# EAGLE design DIN (EAGLE 7.2.0)
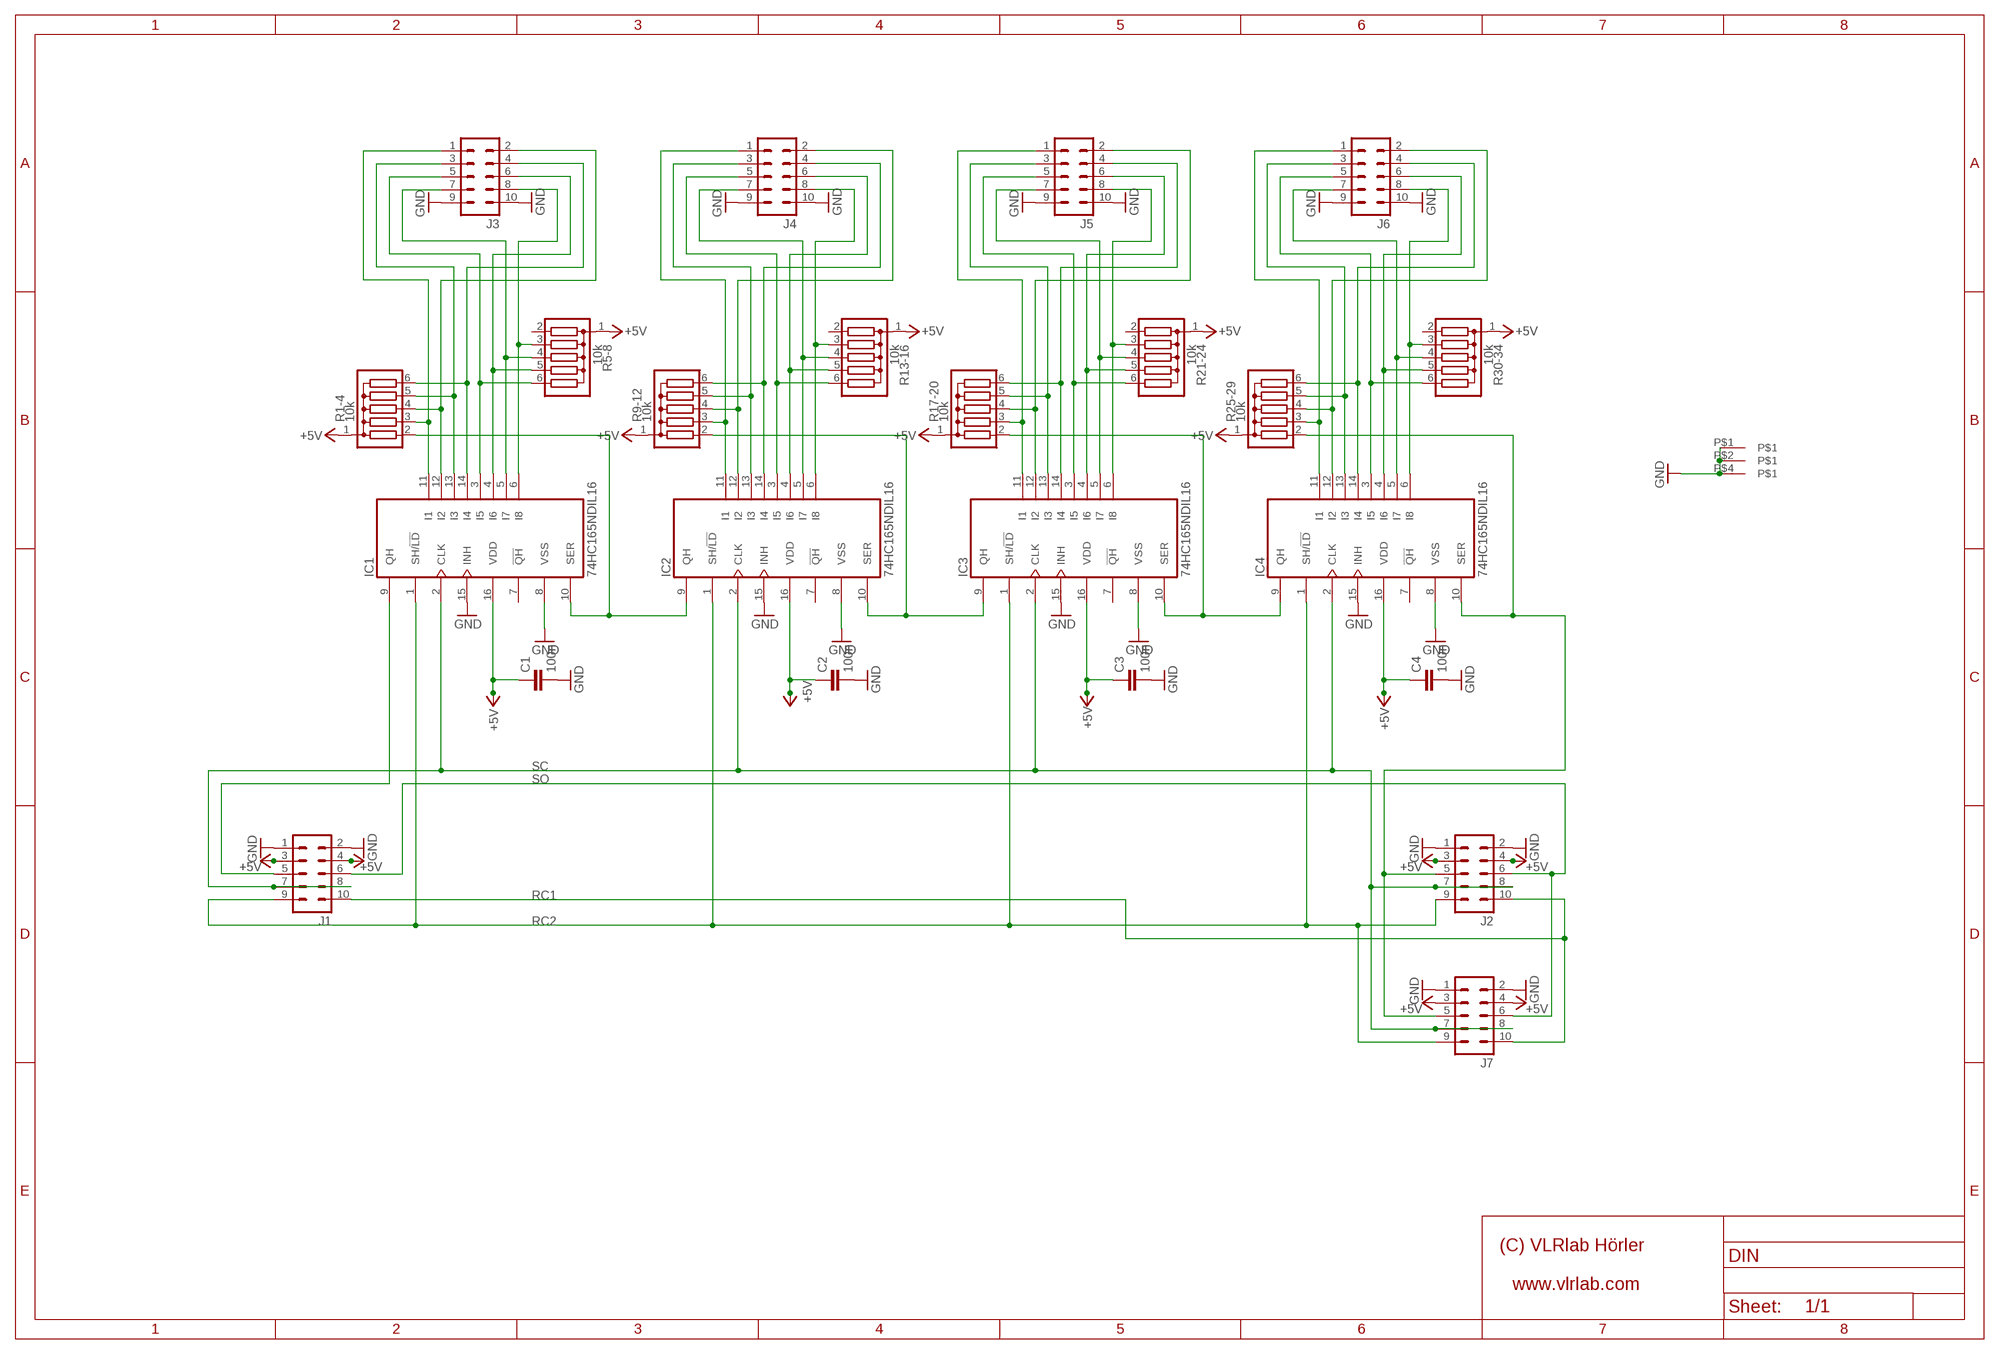
[diagram p0: schematic, sheet 1]

## Parts
C1  100n  C-EU025-025X050  [C025-025X050]
C2  100n  C-EU025-025X050  [C025-025X050]
C3  100n  C-EU025-025X050  [C025-025X050]
C4  100n  C-EU025-025X050  [C025-025X050]
IC1  74HC165NDIL16  [DIL16]
IC2  74HC165NDIL16  [DIL16]
IC3  74HC165NDIL16  [DIL16]
IC4  74HC165NDIL16  [DIL16]
J1  ML10  [ML10]
J2  ML10  [ML10]
J3  ML10  [ML10]
J4  ML10  [ML10]
J5  ML10  [ML10]
J6  ML10  [ML10]
J7  ML10  [ML10]
R1-4  10k  4306R  [SIL6]
R5-8  10k  4306R  [SIL6]
R9-12  10k  4306R  [SIL6]
R13-16  10k  4306R  [SIL6]
R17-20  10k  4306R  [SIL6]
R21-24  10k  4306R  [SIL6]
R25-29  10k  4306R  [SIL6]
R30-34  10k  4306R  [SIL6]
U$7  MIDIBOX_HALF  [MIDIBOX14X6]

## Nets
+5V: C1.1 C2.1 C3.1 C4.1 IC1.16(VDD) IC2.16(VDD) IC3.16(VDD) IC4.16(VDD) J1.3 J1.4 J2.3 J2.4 J7.3 J7.4 R1-4.1 R5-8.1 R9-12.1 R13-16.1 R17-20.1 R21-24.1 R25-29.1 R30-34.1
GND: C1.2 C2.2 C3.2 C4.2 IC1.8(VSS) IC1.15(INH) IC2.8(VSS) IC2.15(INH) IC3.8(VSS) IC3.15(INH) IC4.8(VSS) IC4.15(INH) J1.1 J1.2 J2.1 J2.2 J3.9 J3.10 J4.9 J4.10 J5.9 J5.10 J6.9 J6.10 J7.1 J7.2 U$7.P$1 U$7.P$2 U$7.P$4
N$1: IC1.11(I1) J3.1 R1-4.3
N$2: IC1.12(I2) J3.2 R1-4.4
N$35: IC1.13(I3) J3.3 R1-4.5
N$36: IC1.14(I4) J3.4 R1-4.6
N$37: IC1.3(I5) J3.5 R5-8.6
N$38: IC1.4(I6) J3.6 R5-8.5
N$39: IC1.5(I7) J3.7 R5-8.4
N$40: IC1.6(I8) J3.8 R5-8.3
N$41: IC2.11(I1) J4.1 R9-12.3
N$42: IC2.12(I2) J4.2 R9-12.4
N$43: IC2.13(I3) J4.3 R9-12.5
N$44: IC2.14(I4) J4.4 R9-12.6
N$45: IC2.3(I5) J4.5 R13-16.6
N$46: IC2.4(I6) J4.6 R13-16.5
N$47: IC2.5(I7) J4.7 R13-16.4
N$48: IC2.6(I8) J4.8 R13-16.3
N$49: IC3.11(I1) J5.1 R17-20.3
N$50: IC3.12(I2) J5.2 R17-20.4
N$51: IC3.13(I3) J5.3 R17-20.5
N$52: IC3.14(I4) J5.4 R17-20.6
N$53: IC3.3(I5) J5.5 R21-24.6
N$54: IC3.4(I6) J5.6 R21-24.5
N$55: IC3.5(I7) J5.7 R21-24.4
N$56: IC3.6(I8) J5.8 R21-24.3
N$57: IC4.11(I1) J6.1 R25-29.3
N$58: IC4.12(I2) J6.2 R25-29.4
N$59: IC4.13(I3) J6.3 R25-29.5
N$60: IC4.14(I4) J6.4 R25-29.6
N$61: IC4.3(I5) J6.5 R30-34.6
N$62: IC4.4(I6) J6.6 R30-34.5
N$63: IC4.5(I7) J6.7 R30-34.4
N$64: IC4.6(I8) J6.8 R30-34.3
N$67: IC1.10(SER) IC2.9(QH) R1-4.2
N$68: IC2.10(SER) IC3.9(QH) R9-12.2
N$69: IC3.10(SER) IC4.9(QH) R17-20.2
RC1: J1.10 J2.10 J7.10
RC2: IC1.1(SH/!LD) IC2.1(SH/!LD) IC3.1(SH/!LD) IC4.1(SH/!LD) J1.9 J2.9 J7.9
SC: IC1.2(CLK) IC2.2(CLK) IC3.2(CLK) IC4.2(CLK) J1.7 J1.8 J2.7 J2.8 J7.7 J7.8
SI: IC1.9(QH) J1.5
SI2: IC4.10(SER) J2.5 J7.5 R25-29.2
SO: J1.6 J2.6 J7.6
Unconnected: IC1.7(!QH) IC2.7(!QH) IC3.7(!QH) IC4.7(!QH) R5-8.2 R13-16.2 R21-24.2 R30-34.2

## Library data of the parts
C1-C4 = rcl:C-EU: CAPACITOR, European symbol
IC1-IC4 = 595-541-165-uln2803:74HC165N
J1-J7 = con-ml:ML10: HARTING; OC_FARNELL: unknown; OC_NEWARK: unknown
R1-4 R5-8 R9-12 R13-16 R17-20 R21-24 R25-29 R30-34 = Bourns Resistor Array:4306R
U$7 = Frames_VLR:MIDIBOX_HALF

## Board
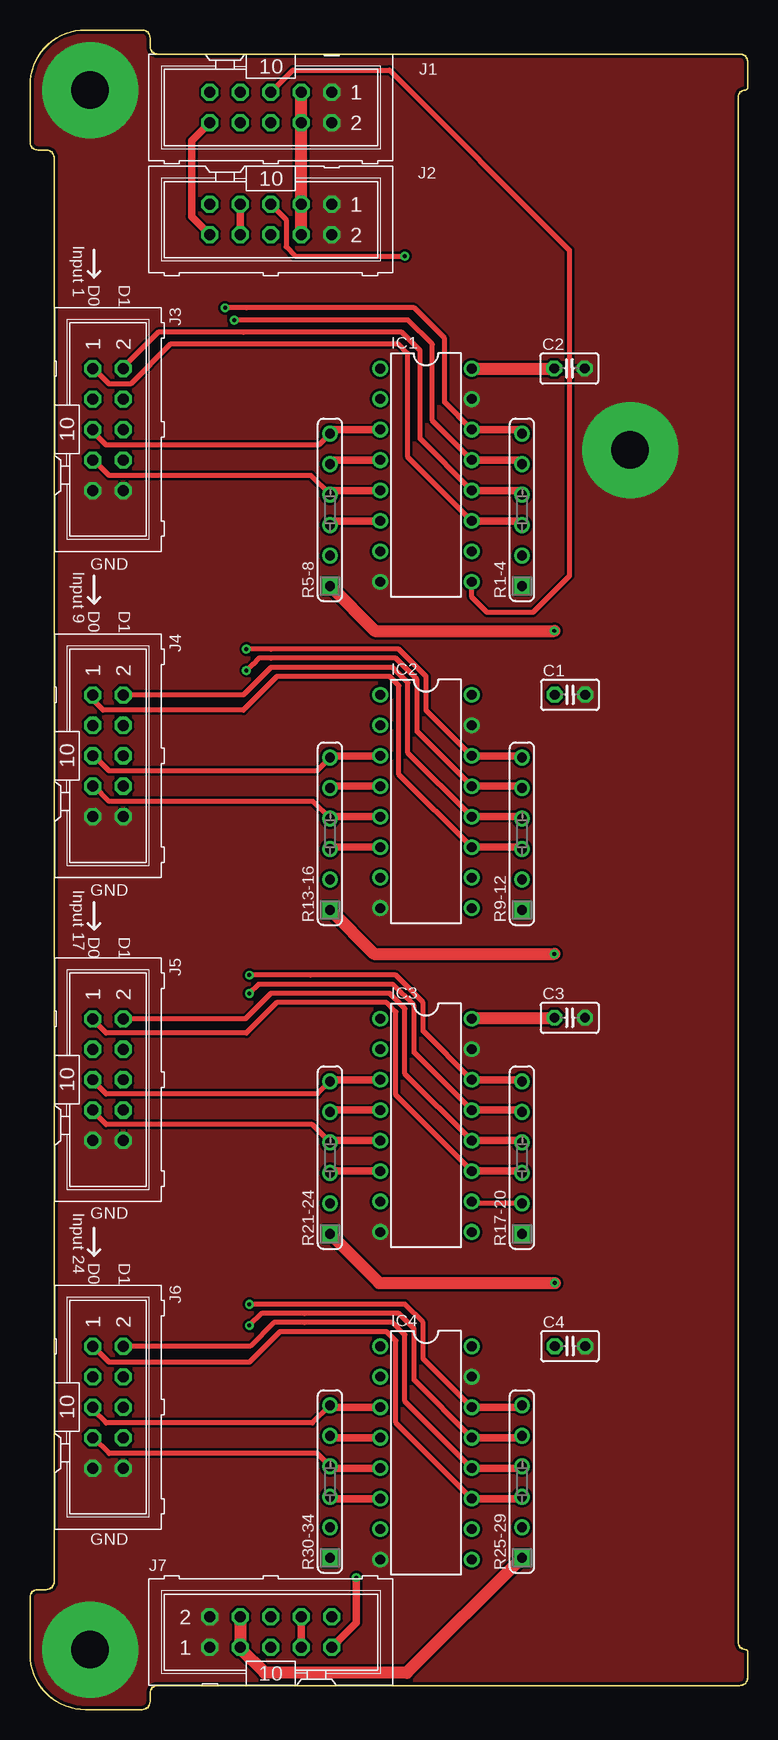
[diagram p1: board, top side]
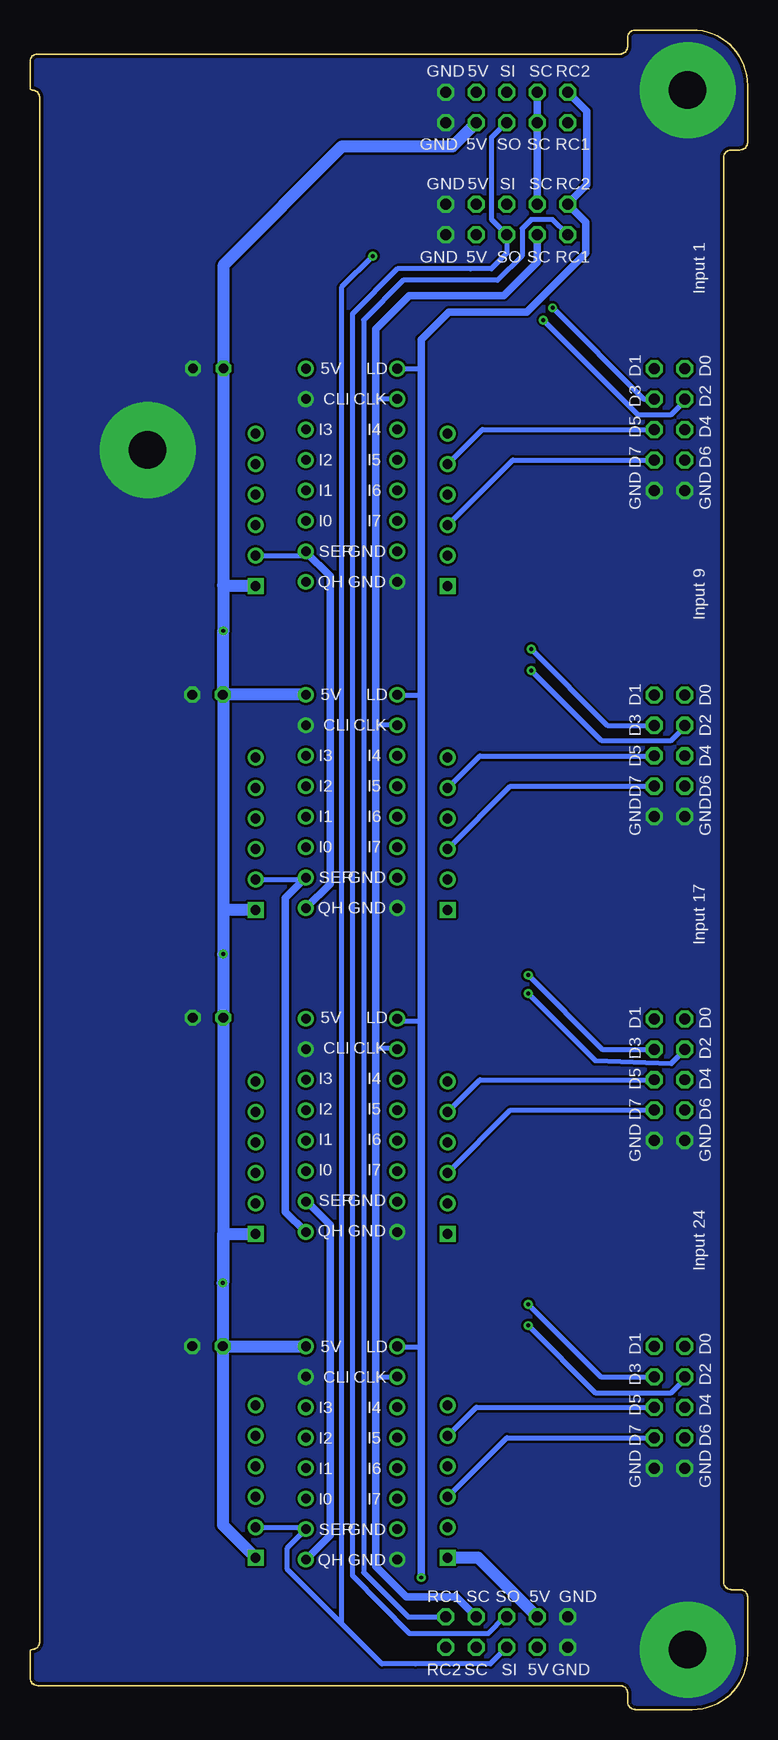
[diagram p2: board, bottom side, seen from below]

Size 59.8 x 140 mm. Coordinates in mm from the lower left corner, seen from the top.
Copper layers (1*16): Top 0.035mm / dielectric 1.5mm / Bottom 0.035mm
Design rules "default *": minimum track width 10mil, minimum drill 24mil, track to track 8mil, track to pad 8mil, pad to pad 8mil, via to via 8mil, smd to smd 8mil, copper to edge 10mil, drill to drill 8mil, minimum pad ring 10mil, minimum via ring 8mil, stop-mask expansion 4mil, vias tented up to drill 0mil, thermal gap 0mil

### Footprints (pad centres in the part's own frame; a part is rotated, then mirrored left to right if it is on the bottom)
C025-025X050 = drill 0.813 octagon: 1 -1.27,0; 2 1.27,0
DIL16 = drill 0.813: 1 -8.89,-3.81; 2 -6.35,-3.81; 3 -3.81,-3.81; 4 -1.27,-3.81; 5 1.27,-3.81; 6 3.81,-3.81; 7 6.35,-3.81; 8 8.89,-3.81; 9 8.89,3.81; 10 6.35,3.81; 11 3.81,3.81; 12 1.27,3.81; 13 -1.27,3.81; 14 -3.81,3.81; 15 -6.35,3.81; 16 -8.89,3.81
ML10 = drill 0.914 octagon: 1 -5.08,-1.27; 2 -5.08,1.27; 3 -2.54,-1.27; 4 -2.54,1.27; 5 0,-1.27; 6 0,1.27; 7 2.54,-1.27; 8 2.54,1.27; 9 5.08,-1.27; 10 5.08,1.27
SIL6 = drill 0.813 square: 1 -6.35,0 | drill 0.813: 2 -3.81,0; 3 -1.27,0; 4 1.27,0; 5 3.81,0; 6 6.35,0
MIDIBOX14X6 = drill 3.1 pad 8: P$1 5,135; P$2 50,105; P$4 5,5

### Placement (x,y rotation side)
C1  45,84.59 0 top
C2  44.95,111.79 0 top
C3  44.97,57.67 0 top
C4  45,30.29 0 top
IC1  33,102.89 270 top
IC2  33,75.69 270 top
IC3  33,48.69 270 top
IC4  33,21.39 270 top
J1  20.07,133.55 180 top
J2  20.07,124.2 180 top
J3  6.5,106.7 270 top
J4  6.5,79.5 270 top
J5  6.5,52.5 270 top
J6  6.5,25.2 270 top
J7  20.07,6.45 0 top
R1-4  41,100 90 top
R5-8  25,100 90 top
R9-12  41,73 90 top
R13-16  25,73 90 top
R17-20  41,46 90 top
R21-24  25,46 90 top
R25-29  41,19 90 top
R30-34  25,19 90 top
U$3  [VLRLAB]  41.66,5.08 0 top
U$4  [VLRLAB]  52.32,5.08 0 bottom
U$5  [DIN]  54.61,135.89 180 top
U$6  [DIN]  42.93,135.89 180 bottom
U$7  0,0 0 top

### Tracks (layer width: path | path; a pad name or v marks a point on that pad's centre or on a via)
+5V  (via drill 0.33)  (1 unrouted)
  Top 1.016: J2.4 J2.3 J1.4 J1.3 | J7.4 J7.3 17.53,5.08 19.56,3.05 31.4,3.05 R25-29.1 | IC3.16 36.89,57.66 36.89,57.67 C3.1 | IC1.16 C2.1 | R21-24.1 29.09,35.56 v43.73,35.56 | R13-16.1 28.66,62.99 v43.69,62.99 | R5-8.1 28.73,89.92 v43.69,89.92
  Bottom 1.016: J1.4 24.59,130.3 33.78,130.3 43.64,120.4 43.68,120.35 C2.1 43.68,93.73 43.73,93.73 43.65,93.65 | R1-4.1 43.65,93.65 | J7.4 22.46,12.65 R30-34.1 | R17-20.1 41.03,39.62 43.7,39.62 | 43.7,39.62 43.73,39.62 | IC4.16 C4.1 | IC2.16 C1.1 | 43.7,39.62 C3.1 43.7,62.98 v43.69,62.99 43.69,66.04 | 43.7,39.62 43.73,39.62 | C4.1 43.73,15.38 R25-29.1 | 43.7,39.62 43.7,35.56 v43.74,35.56 | 43.73,39.62 C4.1 | R9-12.1 43.69,66.65 43.69,66.04 | C1.1 43.69,84.59 43.69,66.04 | C1.1 43.73,89.87 v43.69,89.92 43.69,93.62 43.65,93.65
GND
  pour Bottom: -23.8,149.7 77.8,149.7 77.8,-10.1 -23.8,-10.1 -23.8,149.4
  pour Top: -23.8,149.7 77.8,149.7 77.8,-10.1 -23.8,-10.1 -23.8,149.4
N$1
  Top 0.406: IC1.11 31.5,104.39 31.5,113.03 30.73,113.79 11.68,113.79 8.38,110.49 7.11,110.49 6.6,110.49 5.31,111.78 J3.1
  Top 0.61: R1-4.3 40.65,99.08 IC1.11
N$2
  Top 0.406: IC1.12 32.51,105.92 32.51,113.28 30.99,114.81 17.78,114.81 10.67,114.81 7.77,111.91 J3.2
  Top 0.61: R1-4.4 40.65,101.62 IC1.12
N$35  (via drill 0.33)
  Top 0.406: IC1.13 33.53,107.44 33.53,113.79 31.5,115.82 v17.02,115.82
  Top 0.61: R1-4.5 40.65,104.16 IC1.13
  Bottom 0.406: v17.02,115.82 9.14,107.95 6.35,107.95 5.23,109.07 J3.3
N$36  (via drill 0.33)
  Top 0.406: IC1.14 34.54,108.97 34.54,114.3 32,116.84 18.03,116.84 v16.26,116.84
  Top 0.61: R1-4.6 40.65,106.7 IC1.14
  Bottom 0.406: v16.26,116.84 8.66,109.24 J3.4
N$37
  Top 0.406: R5-8.6 24.06,105.41 6.35,105.41 5.23,106.53 J3.5
  Top 0.61: R5-8.6 25.35,106.7 IC1.3
N$38
  Top 0.61: R5-8.5 25.35,104.16 IC1.4
  Bottom 0.406: R5-8.5 22.11,106.7 J3.6
N$39
  Top 0.406: R5-8.4 23.4,102.87 6.6,102.87 5.31,104.16 J3.7
  Top 0.61: R5-8.4 25.35,101.62 IC1.5
N$40
  Top 0.61: R5-8.3 25.35,99.08 IC1.6
  Bottom 0.406: R5-8.3 19.57,104.16 J3.8
N$41
  Top 0.406: IC2.11 30.73,77.96 30.73,85.34 29.97,86.11 20.57,86.11 17.78,83.31 6.1,83.31 5.23,84.18 J4.1
  Top 0.61: R9-12.3 40.85,71.88 IC2.11
N$42
  Top 0.406: IC2.12 31.5,79.73 31.5,85.6 30.23,86.87 20.07,86.87 17.78,84.58 J4.2
  Top 0.61: R9-12.4 40.85,74.42 IC2.12
N$43  (via drill 0.33)
  Top 0.406: IC2.13 32.26,81.51 32.26,85.85 30.48,87.63 20.07,87.63 19.05,87.63 18.54,87.12 v18.03,86.61
  Top 0.61: R9-12.5 40.85,76.96 IC2.13
  Bottom 0.406: v18.03,86.61 12.19,80.77 6.35,80.77 5.23,81.89 J4.3
N$44  (via drill 0.33)
  Top 0.406: IC2.14 33.02,83.29 33.02,86.11 30.73,88.39 20.07,88.39 v18.03,88.39
  Top 0.61: R9-12.6 40.85,79.5 IC2.14
  Bottom 0.406: v18.03,88.39 11.68,82.04 J4.4
N$45
  Top 0.406: R13-16.6 23.88,78.23 6.6,78.23 5.34,79.5 J4.5
  Top 0.61: R13-16.6 25.15,79.5 IC2.3
N$46
  Top 0.61: R13-16.5 25.15,76.96 IC2.4
  Bottom 0.406: R13-16.5 22.31,79.5 J4.6
N$47
  Top 0.406: R13-16.4 23.58,75.69 6.6,75.69 5.34,76.96 J4.7
  Top 0.61: R13-16.4 25.15,74.42 IC2.5
N$48
  Top 0.61: R13-16.3 25.15,71.88 IC2.6
  Bottom 0.406: R13-16.3 19.77,76.96 J4.8
N$49
  Top 0.406: IC3.11 30.48,51.21 30.48,58.17 29.72,58.93 20.57,58.93 18.03,56.39 6.35,56.39 5.23,57.51 J5.1
  Top 0.61: R17-20.3 40.85,44.88 IC3.11
N$50
  Top 0.406: IC3.12 31.24,52.99 31.24,58.42 29.97,59.69 23.37,59.69 20.07,59.69 17.96,57.58 J5.2
  Top 0.61: R17-20.4 40.85,47.42 IC3.12
N$51  (via drill 0.33)
  Top 0.406: IC3.13 32,54.77 32,58.67 30.23,60.45 23.37,60.45 19.05,60.45 v18.29,59.69
  Top 0.61: R17-20.5 40.85,49.96 IC3.13
  Bottom 0.406: v18.29,59.69 12.7,54.1 6.35,53.85 5.23,54.97 J5.3
N$52  (via drill 0.33)
  Top 0.406: IC3.14 32.77,56.54 32.77,58.93 30.48,61.21 23.37,61.21 v18.29,61.21
  Top 0.61: R17-20.6 40.85,52.5 IC3.14
  Bottom 0.406: v18.29,61.21 12.11,55.04 J5.4
N$53
  Top 0.406: R21-24.6 23.96,51.31 6.35,51.31 5.23,52.43 J5.5
  Top 0.61: R21-24.6 25.15,52.5 IC3.3
N$54
  Top 0.61: R21-24.5 25.15,49.96 IC3.4
  Bottom 0.406: R21-24.5 22.31,52.5 J5.6
N$55
  Top 0.406: R21-24.4 23.5,48.77 6.35,48.77 5.23,49.89 J5.7
  Top 0.61: R21-24.4 25.15,47.42 IC3.5
N$56
  Top 0.61: R21-24.3 25.15,44.88 IC3.6
  Bottom 0.406: R21-24.3 19.77,49.96 J5.8
N$57
  Top 0.406: IC4.11 30.48,23.91 30.48,30.73 29.72,31.5 20.83,31.5 18.29,28.96 6.6,28.96 5.28,30.28 J6.1
  Top 0.61: R25-29.3 40.85,17.58 IC4.11
N$58
  Top 0.406: IC4.12 31.24,25.69 31.24,31.24 30.23,32.26 22.86,32.26 20.32,32.26 18.34,30.28 J6.2
  Top 0.61: R25-29.4 40.85,20.12 IC4.12
N$59  (via drill 0.33)
  Top 0.406: IC4.13 32,27.47 32,31.75 30.73,33.02 22.86,33.02 19.3,33.02 v18.29,32
  Top 0.61: R25-29.5 40.85,22.66 IC4.13
  Bottom 0.406: v18.29,32 12.7,26.42 6.35,26.42 5.23,27.54 J6.3
N$60  (via drill 0.33)
  Top 0.406: IC4.14 32.77,29.24 32.77,32.26 31.24,33.78 22.86,33.78 v18.29,33.78
  Top 0.61: R25-29.6 40.85,25.2 IC4.14
  Bottom 0.406: v18.29,33.78 12.25,27.74 J6.4
N$61
  Top 0.406: R30-34.6 23.53,23.88 6.35,23.88 5.23,25 J6.5
  Top 0.61: R30-34.6 25.15,25.2 IC4.3
N$62
  Top 0.61: R30-34.5 25.15,22.66 IC4.4
  Bottom 0.406: R30-34.5 22.61,25.2 J6.6
N$63
  Top 0.406: R30-34.4 23.93,21.34 6.6,21.34 5.28,22.66 J6.7
  Top 0.61: R30-34.4 25.15,20.12 IC4.5
N$64
  Top 0.61: R30-34.3 25.15,17.58 IC4.6
  Bottom 0.406: R30-34.3 20.07,22.66 J6.8
N$67
  Bottom 0.406: R1-4.2 36.81,96.19 IC1.10
  Bottom 0.61: IC2.9 34.8,68.81 34.8,94.49 36.81,96.5 IC1.10
N$68
  Bottom 0.406: R9-12.2 36.81,69.19 IC2.10
  Bottom 0.61: IC2.10 38.51,67.64 38.51,41.5 IC3.9
N$69
  Top 0.406: R17-20.2 36.81,42.19 IC3.10
  Bottom 0.61: IC4.9 34.8,14.51 34.8,40.39 36.75,42.34 IC3.10
RC1  (1 unrouted)
  Top 0.61: J1.10 13.46,130.75 13.46,124.46 J2.10
  Bottom 0.406: J7.10 28.29,7.72 32,11.43 32,115.82 28.7,119.13 20.83,119.13 18.8,121.16 18.8,123.44 18.03,124.21 17.78,124.21 16.26,124.21 J2.10
  Bottom 0.61: J7.10 25.25,7.62
RC2  (via drill 0.33)
  Top 0.61: v27.2,11 27.2,7.23 J7.9
  Bottom 0.406: IC1.1 29.17,111.76 27.2,111.76 | IC2.1 27.2,84.58 | IC3.1 29.01,57.4 27.2,57.4 | IC4.1 29.14,30.23 27.2,30.23
  Bottom 0.61: J1.9 13.4,133.23 13.4,127.1 14.99,125.51 J2.9 13.5,123.98 13.5,121.4 18.4,116.5 24.9,116.5 27.2,114.2 27.2,111.76 27.2,84.58 27.2,57.4 27.2,30.23 v27.2,11
SC
  Top 0.61: J2.7 J2.8 | J7.7 J7.8
  Bottom 0.406: IC3.2 29.27,55.12 30.99,55.12 | IC2.2 30.99,82.04 | IC1.2 29.21,109.22 30.99,109.22 | IC4.2 29.24,27.69 30.99,27.69
  Bottom 0.61: J2.7 J1.8 J1.7 | J2.8 17.53,120.65 20.32,117.86 28.19,117.86 30.99,115.06 30.99,109.22 30.99,82.04 30.99,55.12 30.99,27.69 30.99,11.94 28.45,9.4 24.29,9.4 J7.8
SI
  Top 0.406: J1.5 21.9,136.65 29.97,136.65 44.96,121.67 44.96,100.08 44.96,94.49 41.91,91.44 38.1,91.44 36.83,92.71 36.83,93.98 IC1.9
SI2  (via drill 0.33)
  Top 0.406: J2.5 21.34,124.2 21.34,121.92 22.1,121.16 v31.24,121.16
  Bottom 0.406: J7.5 21.44,3.81 27.69,3.81 30.48,3.81 33.85,7.18 | 33.85,7.18 38.35,11.68 38.35,13.46 36.81,15.01 IC4.10 36.81,15.19 R25-29.2 | v31.24,121.16 33.85,118.56 33.85,7.18
SO
  Bottom 0.406: J1.6 20.12,132.28 21.34,131.06 21.34,124.2 J2.6 20.07,121.38 21.36,120.09 23.09,120.09 29.18,120.09 32.94,116.33 32.94,11.18 28.19,6.35 21.59,6.35 20.22,7.72 J7.6

### Text on the board
tNames: Input 1 | D0 | D1 | GND | Input 9 | D0 | D1 | GND | Input 17 | D0 | D1 | GND | Input 24 | D0 | D1 | GND
bNames: RC2 | SC | SI | 5V | GND | RC1 | SC | SO | 5V | GND | RC2 | SC | SI | 5V | GND | RC1 | SC | SO | 5V | GND | Input 1 | D0 | D1 | LD | 5V | CLI | D2 | D3 | CLK | D4 | D5 | I4 | I3 | D6 | D7 | I5 | I2 | GND | GND | I6 | I1 | I7 | I0 | GND | SER | GND | QH | Input 9 | D0 | D1 | LD | 5V | CLI | D2 | D3 | CLK | D4 | D5 | I4 | I3 | D6 | D7 | I5 | I2 | GND | GND | I6 | I1 | I7 | I0 | GND | SER | GND | QH | Input 17 | D0 | D1 | LD | 5V | CLI | D2 | D3 | CLK | D4 | D5 | I4 | I3 | D6 | D7 | I5 | I2 | GND | GND | I6 | I1 | I7 | I0 | GND | SER | GND | QH | Input 24 | LD | 5V | D0 | D1 | D2 | D3 | CLI | CLK | D4 | D5 | I4 | I3 | D6 | D7 | I5 | I2 | GND | GND | I6 | I1 | I7 | I0 | GND | SER | GND | QH | GND | 5V | SO | SC | RC1 | GND | 5V | SI | SC | RC2